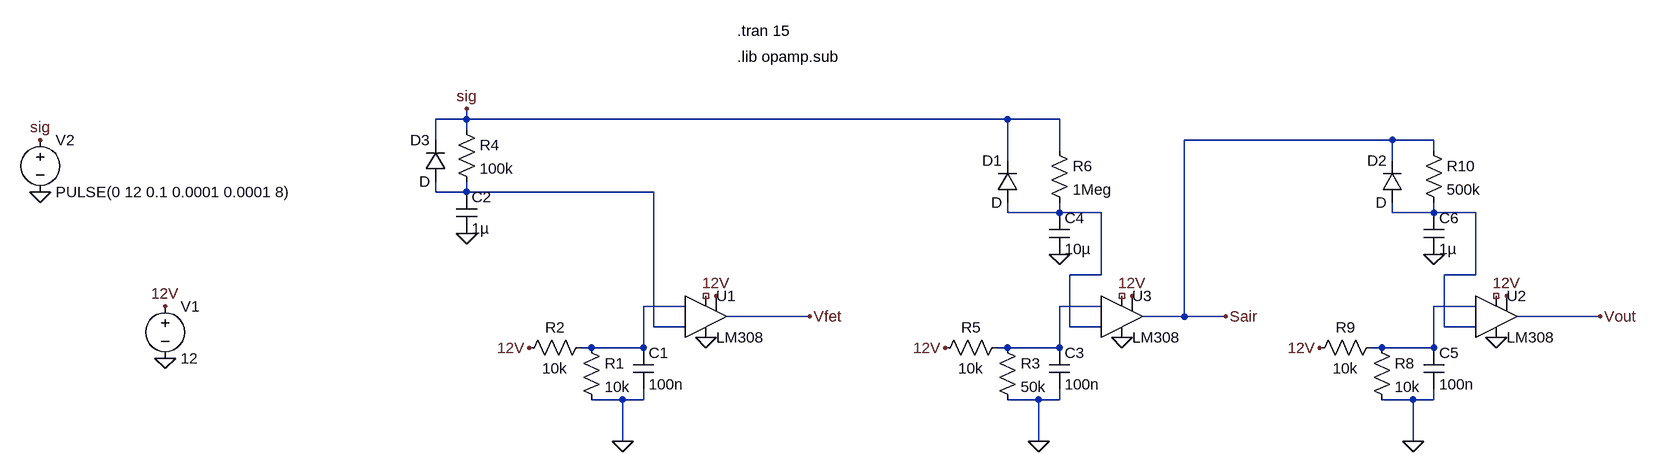
[diagram p0: schematic delay simulation.asc]
delay simulation.asc, the LTspice schematic file:
Version 4
SHEET 1 1624 680
WIRE -192 -160 -192 -176
WIRE -192 -160 -240 -160
WIRE 640 -160 -192 -160
WIRE 720 -160 640 -160
WIRE -192 -144 -192 -160
WIRE -240 -128 -240 -160
WIRE 1232 -128 912 -128
WIRE 1296 -128 1232 -128
WIRE 720 -112 720 -160
WIRE 1296 -112 1296 -128
WIRE 640 -96 640 -160
WIRE 1232 -96 1232 -128
WIRE -240 -48 -240 -64
WIRE -192 -48 -192 -64
WIRE -192 -48 -240 -48
WIRE 96 -48 -192 -48
WIRE 640 -16 640 -32
WIRE 720 -16 720 -32
WIRE 720 -16 640 -16
WIRE 784 -16 720 -16
WIRE 1232 -16 1232 -32
WIRE 1296 -16 1296 -32
WIRE 1296 -16 1232 -16
WIRE 1360 -16 1296 -16
WIRE 784 80 784 -16
WIRE 784 80 736 80
WIRE 1360 80 1360 -16
WIRE 1360 80 1312 80
WIRE 144 128 80 128
WIRE 784 128 720 128
WIRE 1360 128 1296 128
WIRE 336 144 208 144
WIRE 912 144 912 -128
WIRE 912 144 848 144
WIRE 976 144 912 144
WIRE 1552 144 1424 144
WIRE 96 160 96 -48
WIRE 144 160 96 160
WIRE 736 160 736 80
WIRE 784 160 736 160
WIRE 1312 160 1312 80
WIRE 1360 160 1312 160
WIRE 0 192 -16 192
WIRE 80 192 80 128
WIRE 80 192 0 192
WIRE 640 192 624 192
WIRE 720 192 720 128
WIRE 720 192 640 192
WIRE 1216 192 1200 192
WIRE 1296 192 1296 128
WIRE 1296 192 1216 192
WIRE 48 272 0 272
WIRE 80 272 80 256
WIRE 80 272 48 272
WIRE 688 272 640 272
WIRE 720 272 720 256
WIRE 720 272 688 272
WIRE 1264 272 1216 272
WIRE 1296 272 1296 256
WIRE 1296 272 1264 272
WIRE 48 336 48 272
WIRE 688 336 688 272
WIRE 1264 336 1264 272
FLAG 48 336 0
FLAG -656 208 0
FLAG -656 128 12V
FLAG -96 192 12V
FLAG -192 16 0
FLAG -848 -48 0
FLAG -848 -128 sig
FLAG -192 -176 sig
FLAG 688 336 0
FLAG 544 192 12V
FLAG 816 176 0
FLAG 832 112 12V
FLAG 976 144 Sair
FLAG 720 48 0
FLAG 336 144 Vfet
FLAG 176 176 0
FLAG 192 112 12V
FLAG 1264 336 0
FLAG 1120 192 12V
FLAG 1392 176 0
FLAG 1408 112 12V
FLAG 1552 144 Vout
FLAG 1296 48 0
SYMBOL cap 64 192 R0
SYMATTR InstName C1
SYMATTR Value 100n
SYMBOL res -16 176 R0
SYMATTR InstName R1
SYMATTR Value 10k
SYMBOL res 0 176 R90
WINDOW 0 0 56 VBottom 2
WINDOW 3 32 56 VTop 2
SYMATTR InstName R2
SYMATTR Value 10k
SYMBOL voltage -656 112 R0
WINDOW 123 0 0 Left 0
WINDOW 39 0 0 Left 0
SYMATTR InstName V1
SYMATTR Value 12
SYMBOL cap -208 -48 R0
SYMATTR InstName C2
SYMATTR Value 1µ
SYMBOL res -208 -160 R0
SYMATTR InstName R4
SYMATTR Value 100k
SYMBOL voltage -848 -144 R0
WINDOW 123 0 0 Left 0
WINDOW 39 0 0 Left 0
SYMATTR InstName V2
SYMATTR Value PULSE(0 12 0.1 0.0001 0.0001 8)
SYMBOL cap 704 192 R0
SYMATTR InstName C3
SYMATTR Value 100n
SYMBOL res 624 176 R0
SYMATTR InstName R3
SYMATTR Value 50k
SYMBOL res 640 176 R90
WINDOW 0 0 56 VBottom 2
WINDOW 3 32 56 VTop 2
SYMATTR InstName R5
SYMATTR Value 10k
SYMBOL cap 704 -16 R0
SYMATTR InstName C4
SYMATTR Value 10µ
SYMBOL res 704 -128 R0
SYMATTR InstName R6
SYMATTR Value 1Meg
SYMBOL Opamps\\LM308 816 80 R0
SYMATTR InstName U3
SYMBOL Opamps\\LM308 176 80 R0
SYMATTR InstName U1
SYMBOL cap 1280 192 R0
SYMATTR InstName C5
SYMATTR Value 100n
SYMBOL res 1200 176 R0
SYMATTR InstName R8
SYMATTR Value 10k
SYMBOL res 1216 176 R90
WINDOW 0 0 56 VBottom 2
WINDOW 3 32 56 VTop 2
SYMATTR InstName R9
SYMATTR Value 10k
SYMBOL cap 1280 -16 R0
SYMATTR InstName C6
SYMATTR Value 1µ
SYMBOL res 1280 -128 R0
SYMATTR InstName R10
SYMATTR Value 500k
SYMBOL Opamps\\LM308 1392 80 R0
SYMATTR InstName U2
SYMBOL diode 656 -32 R180
WINDOW 0 24 64 Left 2
WINDOW 3 24 0 Left 2
SYMATTR InstName D1
SYMBOL diode 1248 -32 R180
WINDOW 0 24 64 Left 2
WINDOW 3 24 0 Left 2
SYMATTR InstName D2
SYMBOL diode -224 -64 R180
WINDOW 0 24 64 Left 2
WINDOW 3 24 0 Left 2
SYMATTR InstName D3
TEXT 224 -296 Left 2 !.tran 15
TEXT 224 -256 Left 2 !.lib opamp.sub

The netlist it stands for:
* delay simulation.asc
C1 N004 0 100n
R1 N004 0 10k
R2 N004 12V 10k
V1 12V 0 12
C2 N001 0 1µ
R4 sig N001 100k
V2 sig 0 PULSE(0 12 0.1 0.0001 0.0001 8)
C3 N005 0 100n
R3 N005 0 50k
R5 N005 12V 10k
C4 N002 0 10µ
R6 sig N002 1Meg
XU3 N002 N005 12V 0 Sair NC_01 NC_02 LT1008
XU1 N001 N004 12V 0 Vfet NC_03 NC_04 LT1008
C5 N006 0 100n
R8 N006 0 10k
R9 N006 12V 10k
C6 N003 0 1µ
R10 Sair N003 500k
XU2 N003 N006 12V 0 Vout NC_05 NC_06 LT1008
D1 N002 sig D
D2 N003 Sair D
D3 N001 sig D
.model D D
.lib standard.dio
.tran 15
.lib opamp.sub
.lib LTC.lib
.backanno
.end